# Altium schematic sheet raspberrypi.SchDoc: Test
size A4; DrawnBy: Łukasz Przeniosło; Organization: Zachodniopomorski; Address1: Uniwersytet Technologiczny; Address2: w Szczecinie; Address3: Wydział Elektryczny; DocumentNumber: 2; Revision: 1.0; SheetNumber: 2; SheetTotal: 8
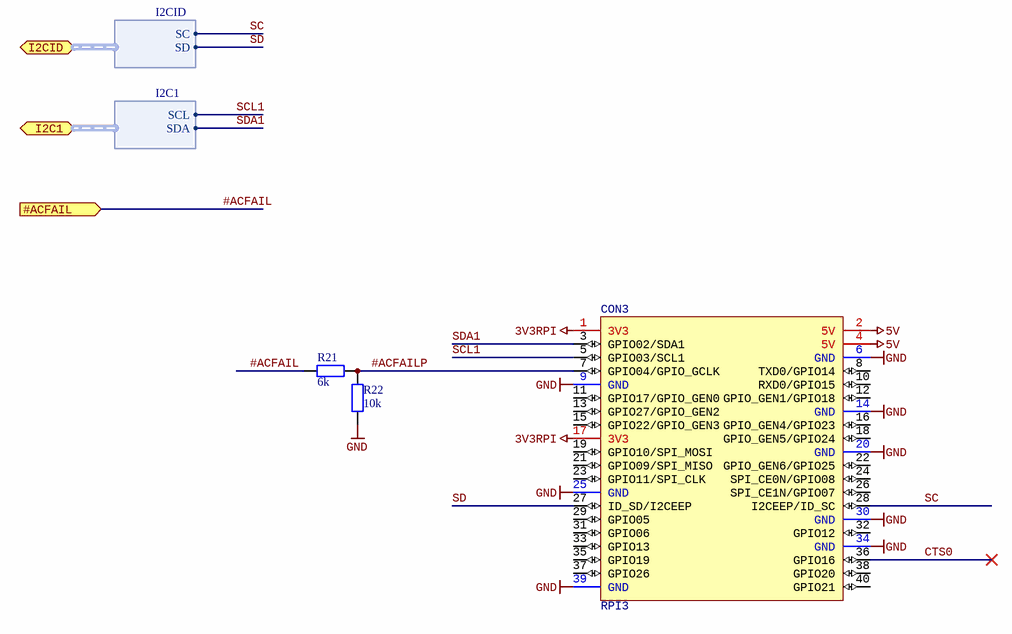
[diagram p0: raspberrypi.SchDoc]

## Parts
CON3  RPI3  [RaspberryPi3_CON]
R21  6k  [RESC1608N]
R22  10k  [RESC1608N]

## Ports
#ACFAIL (in), I2C1 (harness I2C1), I2CID (harness I2CID)

## Harnesses
I2CID: SC, SD
I2C1: SCL, SDA

## Nets
3V3RPI: CON3.1(3V3) CON3.17(3V3)
5V: CON3.2(5V) CON3.4(5V)
GND: CON3.6(GND) CON3.9(GND) CON3.14(GND) CON3.20(GND) CON3.25(GND) CON3.30(GND) CON3.34(GND) CON3.39(GND) R22.1
#ACFAIL: R21.2 ; port #ACFAIL
#ACFAILP: CON3.7(GPIO04/GPIO_GCLK) R21.1 R22.2
CTS0: CON3.36(GPIO16)
SC: CON3.28(I2CEEP/ID_SC) ; port I2CID.SC
SCL1: CON3.5(GPIO03/SCL1) ; port I2C1.SCL
SD: CON3.27(ID_SD/I2CEEP) ; port I2CID.SD
SDA1: CON3.3(GPIO02/SDA1) ; port I2C1.SDA

Not connected (* = marked no-connect by the designer): CON3 8(TXD0/GPIO14) 10(RXD0/GPIO15) 11(GPIO17/GPIO_GEN0) 12(GPIO_GEN1/GPIO18) 13(GPIO27/GPIO_GEN2) 15(GPIO22/GPIO_GEN3) 16(GPIO_GEN4/GPIO23) 18(GPIO_GEN5/GPIO24) 19(GPIO10/SPI_MOSI) 21(GPIO09/SPI_MISO) 22(GPIO_GEN6/GPIO25) 23(GPIO11/SPI_CLK) 24(SPI_CE0N/GPIO08) 26(SPI_CE1N/GPIO07) 29(GPIO05) 31(GPIO06) 32(GPIO12) 33(GPIO13) 35(GPIO19) 37(GPIO26) 38(GPIO20) 40(GPIO21)

## Notes on the sheet
- Title
- Size:
- Date:
- A4
- Author:
- Time:
- Sheet
- of
- File:

## Library data of the parts
CON3 = RaspberryPiCon: Raspberry pi model 3B connector with step
R21 R22 = Resistor: Tolerance: 5%; Power: 0W
  R21: Value: 6k
  R22: Value: 10k